# Altium project 2014_BallLauncher.PRJPCB
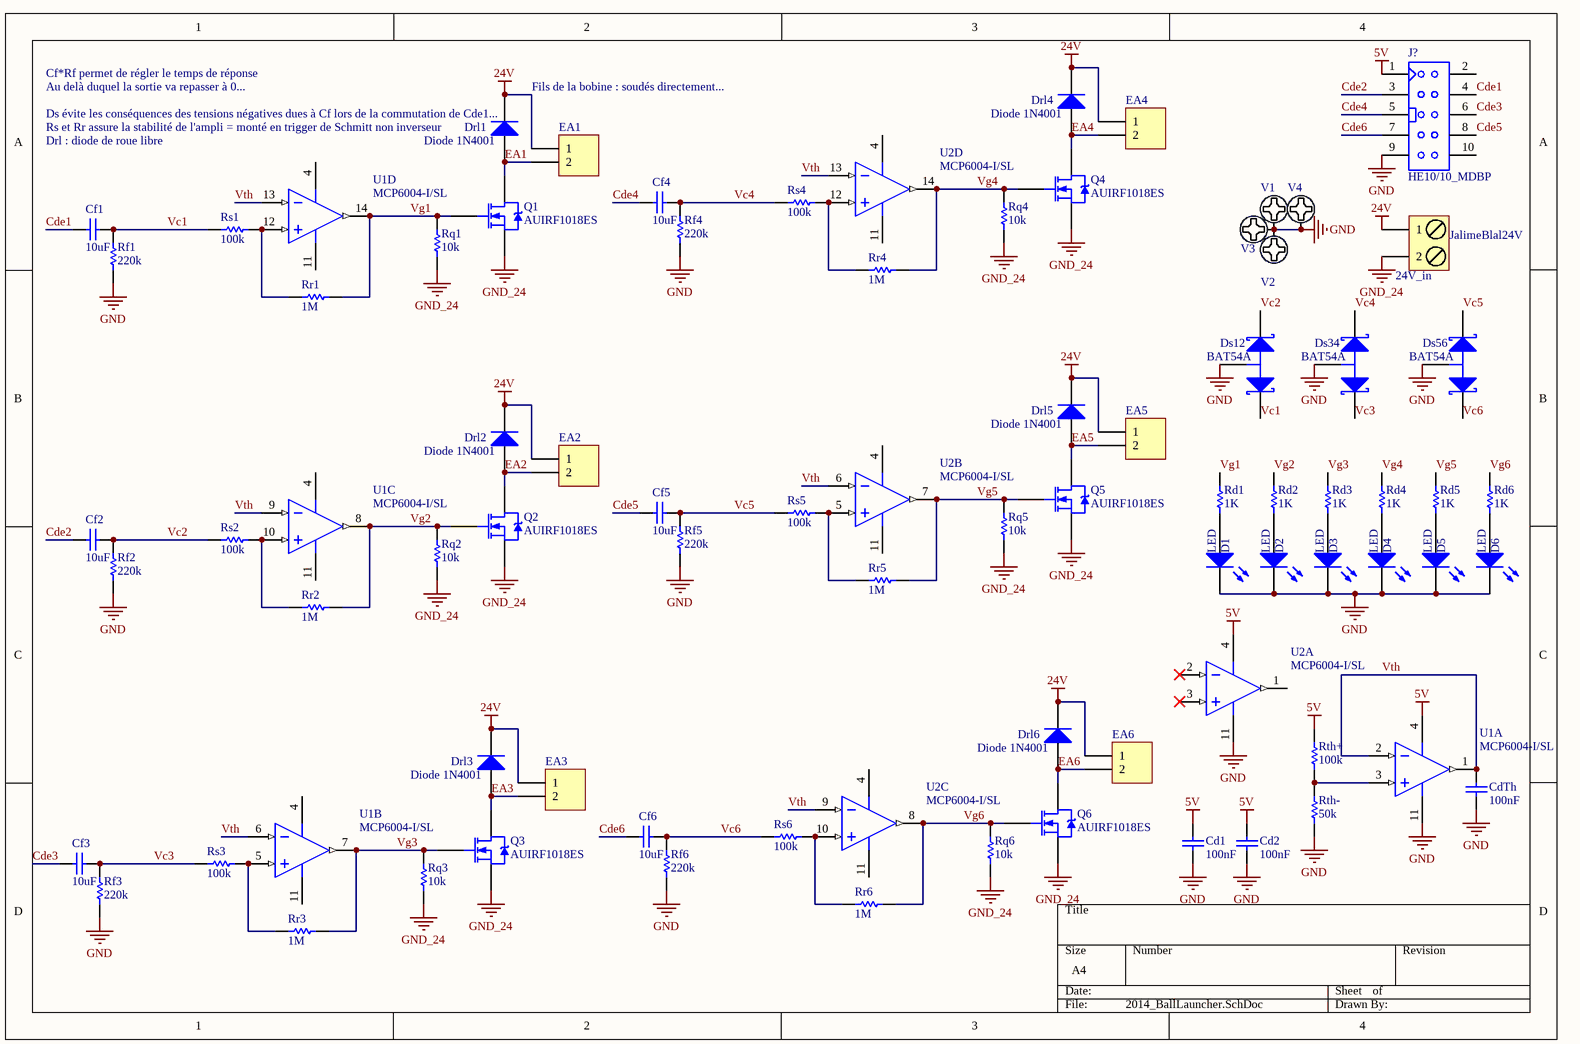
[diagram p0: 2014_BallLauncher.SchDoc]
1 sheet, 76 parts. Net scope: global (net labels, ports and power ports of the same name join across sheets).
Board file: 2014_BallLauncher.PCBDOC

## Sheet 2014_BallLauncher.SchDoc
size A4

### Parts
Cd1  100nF  [C0805_N]
Cd2  100nF  [C0805_N]
CdTh  100nF  [C0805_N]
Cf1  10uF  [C1206_N]
Cf2  10uF  [C1206_N]
Cf3  10uF  [C1206_N]
Cf4  10uF  [C1206_N]
Cf5  10uF  [C1206_N]
Cf6  10uF  [C1206_N]
D1  LED  [LED_0805]
D2  LED  [LED_0805]
D3  LED  [LED_0805]
D4  LED  [LED_0805]
D5  LED  [LED_0805]
D6  LED  [LED_0805]
Drl1  Diode 1N4001  [DIO10.46-5.3x2.8]
Drl2  Diode 1N4001  [DIO10.46-5.3x2.8]
Drl3  Diode 1N4001  [DIO10.46-5.3x2.8]
Drl4  Diode 1N4001  [DIO10.46-5.3x2.8]
Drl5  Diode 1N4001  [DIO10.46-5.3x2.8]
Drl6  Diode 1N4001  [DIO10.46-5.3x2.8]
Ds12  BAT54A  [SOT23-3N]
Ds34  BAT54A  [SOT23-3N]
Ds56  BAT54A  [SOT23-3N]
EA1  BARRETTE2  [HDR1X2]  (value not drawn)
EA2  BARRETTE2  [HDR1X2]  (value not drawn)
EA3  BARRETTE2  [HDR1X2]  (value not drawn)
EA4  BARRETTE2  [HDR1X2]  (value not drawn)
EA5  BARRETTE2  [HDR1X2]  (value not drawn)
EA6  BARRETTE2  [HDR1X2]  (value not drawn)
J?  Type: HE10/10_MDBP  [HE10/10_M_D_BP]  (hidden comment: HE10/10_MALE_DROIT_BAS_PROFIL)
JalimeBlal24V  24V_in  [BORNIER2_FEM_COUDE]
Q1  AUIRF1018ES  [D2PAK]
Q2  AUIRF1018ES  [D2PAK]
Q3  AUIRF1018ES  [D2PAK]
Q4  AUIRF1018ES  [D2PAK]
Q5  AUIRF1018ES  [D2PAK]
Q6  AUIRF1018ES  [D2PAK]
Rd1  1K  [R1206_N]
Rd2  1K  [R1206_N]
Rd3  1K  [R1206_N]
Rd4  1K  [R1206_N]
Rd5  1K  [R1206_N]
Rd6  1K  [R1206_N]
Rf1  220k  [R1206_N]
Rf2  220k  [R1206_N]
Rf3  220k  [R1206_N]
Rf4  220k  [R1206_N]
Rf5  220k  [R1206_N]
Rf6  220k  [R1206_N]
Rq1  10k  [R1206_N]
Rq2  10k  [R1206_N]
Rq3  10k  [R1206_N]
Rq4  10k  [R1206_N]
Rq5  10k  [R1206_N]
Rq6  10k  [R1206_N]
Rr1  1M  [R1206_N]
Rr2  1M  [R1206_N]
Rr3  1M  [R1206_N]
Rr4  1M  [R1206_N]
Rr5  1M  [R1206_N]
Rr6  1M  [R1206_N]
Rs1  100k  [R1206_N]
Rs2  100k  [R1206_N]
Rs3  100k  [R1206_N]
Rs4  100k  [R1206_N]
Rs5  100k  [R1206_N]
Rs6  100k  [R1206_N]
Rth+  100k  [R1206_N]
Rth-  50k  [R1206_N]
U1  MCP6004-I/SL  [SOIC-SL14_N]  (parts A,B,C,D of 4)
U2  MCP6004-I/SL  [SOIC-SL14_N]  (parts A,B,C,D of 4)
V1  Pad_M3  [M3x6mm]  (value not drawn)
V2  Pad_M3  [M3x6mm]  (value not drawn)
V3  Pad_M3  [M3x6mm]  (value not drawn)
V4  Pad_M3  [M3x6mm]  (value not drawn)

### Nets
5V: Cd1.1 Cd2.1 J?.1 Rth+.2 U1.4(VDD) U2.4(VDD)
24V: Drl1.2(K) Drl2.2(K) Drl3.2(K) Drl4.2(K) Drl5.2(K) Drl6.2(K) EA1.1 EA2.1 EA3.1 EA4.1 EA5.1 EA6.1 JalimeBlal24V.1
GND: Cd1.2 Cd2.2 CdTh.2 D1.2(K) D2.2(K) D3.2(K) D4.2(K) D5.2(K) D6.2(K) Ds12.3(A) Ds34.3(A) Ds56.3(A) J?.9 Rf1.1 Rf2.1 Rf3.1 Rf4.1 Rf5.1 Rf6.1 Rth-.1 U1.11(VSS) U2.11(VSS) V1.1 V2.1 V3.1 V4.1
GND_24: JalimeBlal24V.2 Q1.3(S) Q2.3(S) Q3.3(S) Q4.3(S) Q5.3(S) Q6.3(S) Rq1.2 Rq2.2 Rq3.2 Rq4.2 Rq5.2 Rq6.2
Cde1: Cf1.2 J?.4
Cde2: Cf2.2 J?.3
Cde3: Cf3.2 J?.6
Cde4: Cf4.2 J?.5
Cde5: Cf5.2 J?.8
Cde6: Cf6.2 J?.7
EA1: Drl1.1(A) EA1.2 Q1.2(D)
EA2: Drl2.1(A) EA2.2 Q2.2(D)
EA3: Drl3.1(A) EA3.2 Q3.2(D)
EA4: Drl4.1(A) EA4.2 Q4.2(D)
EA5: Drl5.1(A) EA5.2 Q5.2(D)
EA6: Drl6.1(A) EA6.2 Q6.2(D)
Vc1: Cf1.1 Ds12.1(K1) Rf1.2 Rs1.1
Vc2: Cf2.1 Ds12.2(K2) Rf2.2 Rs2.1
Vc3: Cf3.1 Ds34.1(K1) Rf3.2 Rs3.1
Vc4: Cf4.1 Ds34.2(K2) Rf4.2 Rs4.1
Vc5: Cf5.1 Ds56.2(K2) Rf5.2 Rs5.1
Vc6: Cf6.1 Ds56.1(K1) Rf6.2 Rs6.1
Vg1: Q1.1(G) Rd1.1 Rq1.1 Rr1.2 U1.14(VOUTD)
Vg2: Q2.1(G) Rd2.1 Rq2.1 Rr2.2 U1.8(VOUTC)
Vg3: Q3.1(G) Rd3.1 Rq3.1 Rr3.2 U1.7(VOUTB)
Vg4: Q4.1(G) Rd4.1 Rq4.1 Rr4.2 U2.14(VOUTD)
Vg5: Q5.1(G) Rd5.1 Rq5.1 Rr5.2 U2.7(VOUTB)
Vg6: Q6.1(G) Rd6.1 Rq6.1 Rr6.2 U2.8(VOUTC)
Vth: CdTh.1 U1.1(VOUTA) U1.2(VINA-) U1.6(VINB-) U1.9(VINC-) U1.13(VIND-) U2.6(VINB-) U2.9(VINC-) U2.13(VIND-)
NetD1_1: D1.1(A) Rd1.2
NetD2_1: D2.1(A) Rd2.2
NetD3_1: D3.1(A) Rd3.2
NetD4_1: D4.1(A) Rd4.2
NetD5_1: D5.1(A) Rd5.2
NetD6_1: D6.1(A) Rd6.2
NetRr1_1: Rr1.1 Rs1.2 U1.12(VIND+)
NetRr2_1: Rr2.1 Rs2.2 U1.10(VINC+)
NetRr3_1: Rr3.1 Rs3.2 U1.5(VINB+)
NetRr4_1: Rr4.1 Rs4.2 U2.12(VIND+)
NetRr5_1: Rr5.1 Rs5.2 U2.5(VINB+)
NetRr6_1: Rr6.1 Rs6.2 U2.10(VINC+)
NetRth+_1: Rth+.1 Rth-.2 U1.3(VINA+)

Not connected (* = marked no-connect by the designer): J? 2 10; U2 1(VOUTA) 2(VINA-)* 3(VINA+)*

### Notes on the sheet
- Cf*Rf permet de régler le temps de réponse
- Au delà duquel la sortie va repasser à 0...
- (near Drl1) Ds évite les conséquences des tensions négatives dues à Cf lors de la commutation de Cde1...
- Fils de la bobine : soudés directement...
- (near Drl1) Rs et Rr assure la stabilité de l'ampli = monté en trigger de Schmitt non inverseur
- Drl : diode de roue libre

### Library data of the parts
Cd1 Cd2 CdTh Cf1-Cf6 = Condensateur: Capacitor; Published: 8-Jun-2000; LatestRevisionDate: 17-Jul-2002; LatestRevisionNote: Re-released for DXP Platform.; PackageReference: RAD-0.3; Publisher: Altium Limited
D1-D6 = LED: Typical LED; Published: 8-Jun-2000; LatestRevisionDate: 08-Jul-2005; LatestRevisionNote: Mech Layer 1 removed.; PackageReference: LED-1; Publisher: Altium Limited
Drl1-Drl6 = Diode 1N4001: 1 Amp General Purpose Rectifier; Published: 8-Jun-2000; LatestRevisionDate: 17-Jul-2002; LatestRevisionNote: Re-released for DXP Platform.; DatasheetVersion: 1998; PackageVersion: Aug-1999; PackageReference: DO-41; Publisher: Altium Limited; Code_JEDEC: DO-204-AL; ComponentLink1Description: Manufacturer Link; ComponentLink1URL: http://www.fairchildsemi.com/; ComponentLink2Description: Datasheet; ComponentLink2URL: http://www.fairchildsemi.com/ds/1N%2F1N4001.pdf
Ds12 Ds34 Ds56 = Diode Shottky double  BAT54A: DIODE SCHOTTKY DOUBLE; Manufacturer: ZETEX; Description: ZETEX - BAT54A - DIODE SCHOTTKY DOUBLE; ComponentLink1URL: http://www.farnell.com/datasheets/27632.pdf; ComponentLink1Description: http://www.farnell.com/datasheets/27632.pdf; Supplier Part Number: 9526498; Supplier: Farnell; RoHS: YES; Manufacturer Part Number: BAT54A
EA1-EA6 = BARRETTE2: Header, 2-Pin; LatestRevisionDate: 17-Jul-2002; LatestRevisionNote: Re-released for DXP Platform.; Publisher: Altium Limited
J? = HE10/10_MALE_DROIT_BAS_PROFIL: EMBASE HE10/10 MALE DROIT BAS PROFIL
JalimeBlal24V = BORNIER2: Terminal blocks, 2 pins, pitch=5mm
Q1-Q6 = IRF1010S: HEXFET N-Channel Power MOSFET; Published: 8-Jun-2000; LatestRevisionDate: 17-Jul-2002; LatestRevisionNote: Re-released for DXP Platform.; DatasheetVersion: PD-9.923; PackageReference: D2PAK; Publisher: Altium Limited; PackageDescription: D2-PAK/TO-263-AB; 3 Leads (1 Cropped); Body 15.5 (inc. leads) x 10.5 mm (LxW max); ComponentLink1Description: Manufacturer Link; ComponentLink1URL: http://www.irf.com/; ComponentLink2Description: Datasheet; ComponentLink2URL: http://www.irf.com/product-info/datasheets/data/irf1010ns.pdf
Rd1-Rd6 Rf1-Rf6 Rq1-Rq6 Rr1-Rr6 Rs1-Rs6 Rth+ Rth- = Resistor: Published: 8-Jun-2000; LatestRevisionDate: 17-Jul-2002; LatestRevisionNote: Re-released for DXP Platform.; PackageReference: AXIAL-0.5; Publisher: Altium Limited
U1 U2 = MCP6004-I/SL: 1 MHz, Low-Power Operational Amplifier, 14-Pin SOIC, Industrial Temperature; FirstPublished: 29-Jan-2009; LatestRevisionDate: 02-Dec-2009; LatestRevisionNote: Updated to datasheet revision J, Nov-2009; DatasheetVersion: revJ, Nov-2009; PackageVersion: revBB, Aug-2009; PackageReference: SOIC-SL14; Publisher: Altium Limited; PackageDescription: 14-Lead Plastic Small Outline (SL) - Narrow, 3.90mm Body [SOIC]; Supplier 1: Digi-Key; Supplier Part Number 1: MCP6004-I/SL-ND; Supplier 2: Farnell; Supplier Part Number 2: 6530837; Supplier 3: Newark; Supplier Part Number 3: 72C4276; Code_JEDEC: MS-012-AB; Code_IPC: SOIC127P600-14; ComponentLink1Description: Datasheet; ComponentLink1URL: http://ww1.microchip.com/downloads/en/DeviceDoc/21733j.pdf; ComponentLink2Description: Packaging Specification; ComponentLink2URL: http://www.microchip.com/stellent/groups/techpub_sg/documents/packagingspec/en012702.pdf; ComponentLink3Description: Microchip.com Home; ComponentLink3URL: http://www.microchip.com/
V1-V4 = Vis M3 X 6mm _TORX_Tête 6mm: Publisher: Damien Guitton